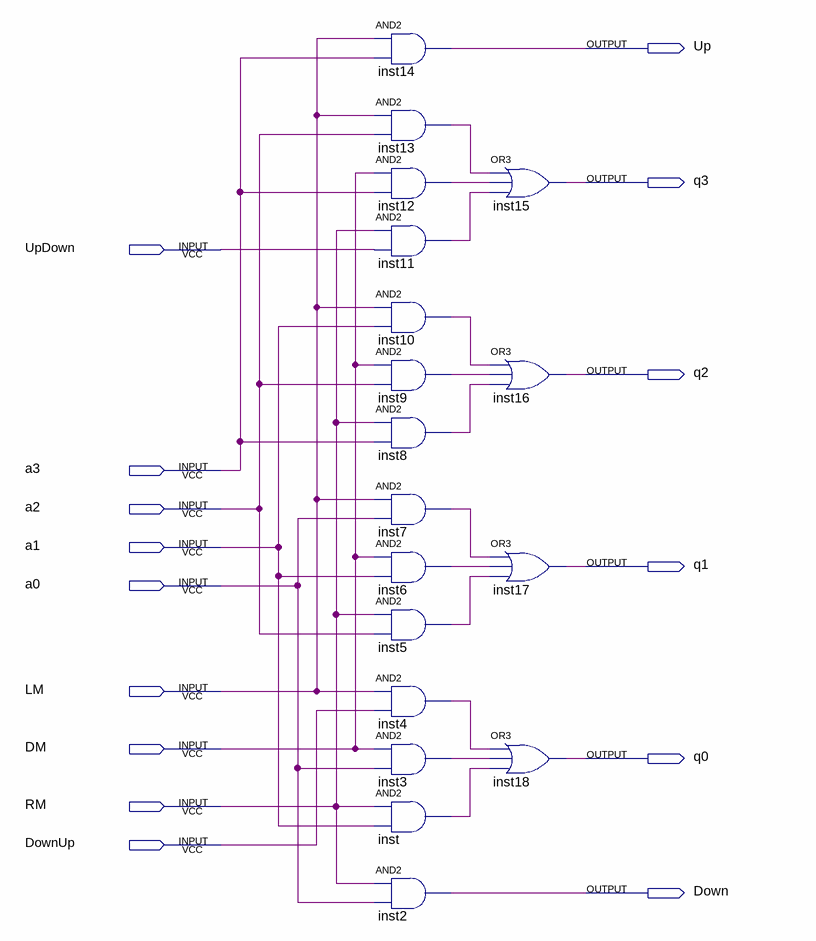
[diagram p0: schematic sheet]
// Quartus schematic Shifter4.bdf as structural Verilog: 18 symbols, 15 pins
module Shifter4 (
  input  UpDown,
  input  a3,
  input  a2,
  input  a1,
  input  a0,
  input  LM,
  input  DM,
  input  RM,
  input  DownUp,
  output Up,
  output q3,
  output q2,
  output q1,
  output q0,
  output Down
);

  wire inst3_out, inst4_out, inst5_out, inst6_out, inst7_out, inst8_out, inst9_out, inst10_out, inst11_out,
       inst12_out, inst13_out, inst_out;

  and inst14 (Up, LM, a3);
  and inst13 (inst13_out, LM, a2);
  and inst12 (inst12_out, DM, a3);
  and inst11 (inst11_out, RM, UpDown);
  and inst10 (inst10_out, LM, a1);
  and inst9 (inst9_out, DM, a2);
  and inst8 (inst8_out, RM, a3);
  and inst7 (inst7_out, LM, a0);
  and inst6 (inst6_out, DM, a1);
  and inst5 (inst5_out, RM, a2);
  and inst4 (inst4_out, LM, DownUp);
  and inst3 (inst3_out, DM, a0);
  and inst (inst_out, RM, a1);
  and inst2 (Down, RM, a0);
  or inst15 (q3, inst13_out, inst12_out, inst11_out);
  or inst16 (q2, inst10_out, inst9_out, inst8_out);
  or inst17 (q1, inst7_out, inst6_out, inst5_out);
  or inst18 (q0, inst4_out, inst3_out, inst_out);
endmodule
